# Altium project Led_panel.PrjPCB
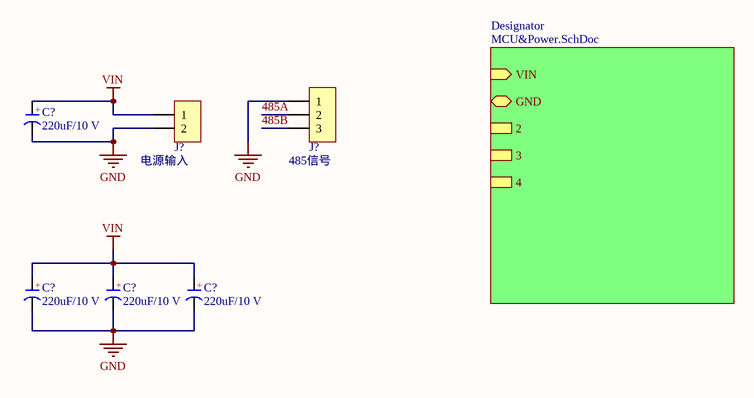
[diagram p0: Main.SchDoc]
3 sheets, 83 parts. Net scope: hierarchical (ports join the sheet entries above them; power ports are global).
Sheets:
  Main.SchDoc
    Designator = MCU&Power.SchDoc
  Row_IC.SchDoc

## Sheet Main.SchDoc
size A4

### Parts
(Parts that share a designator on the sheet are numbered #1, #2 ... from top to bottom, then left to right.)
C?#1  220uF/10 V  [CAP 1.5*4*8]
C?#2  220uF/10 V  [CAP 1.5*4*8]
C?#3  220uF/10 V  [CAP 1.5*4*8]
C?#4  220uF/10 V  [CAP 1.5*4*8]
J?#1  HDR-1X3  [KF2EDGK5.0-WI-3P]  (value not drawn)
J?#2  HDR-1X2  [KF2EDGK5.0-WI-2P]  (value not drawn)

### Sub-sheets
Designator = MCU&Power.SchDoc: VIN (in), GND (bidir), 2, 3, 4

### Nets
GND: C?#1.2(K) C?#2.2(K) C?#3.2(K) C?#4.2(K) J?#1.1 J?#2.2 ; sheet Designator/GND
VIN: C?#1.1(A) C?#2.1(A) C?#3.1(A) C?#4.1(A) J?#2.1 ; sheet Designator/VIN
485A: J?#1.2
485B: J?#1.3

### Notes on the sheet
- (near J?#2) 电源输入
- (near J?#1) 485信号
- (in symbol C-CAP) +

### Library data of the parts
C?#1-C?#4 = C-CAP: 直插电解电容; 版权归属: 源创客; BOM名称: 直插电解电容; 学习资源: www.ooocke.com
J?#1 = Header 3: 3P接插件; 版权归属: 源创客; BOM名称: 3P接插件; 学习资源: www.ooocke.com
J?#2 = Header 2: 2P接插件; 版权归属: 源创客; BOM名称: 2P接插件; 学习资源: www.ooocke.com

## Sheet MCU&Power.SchDoc
size A4
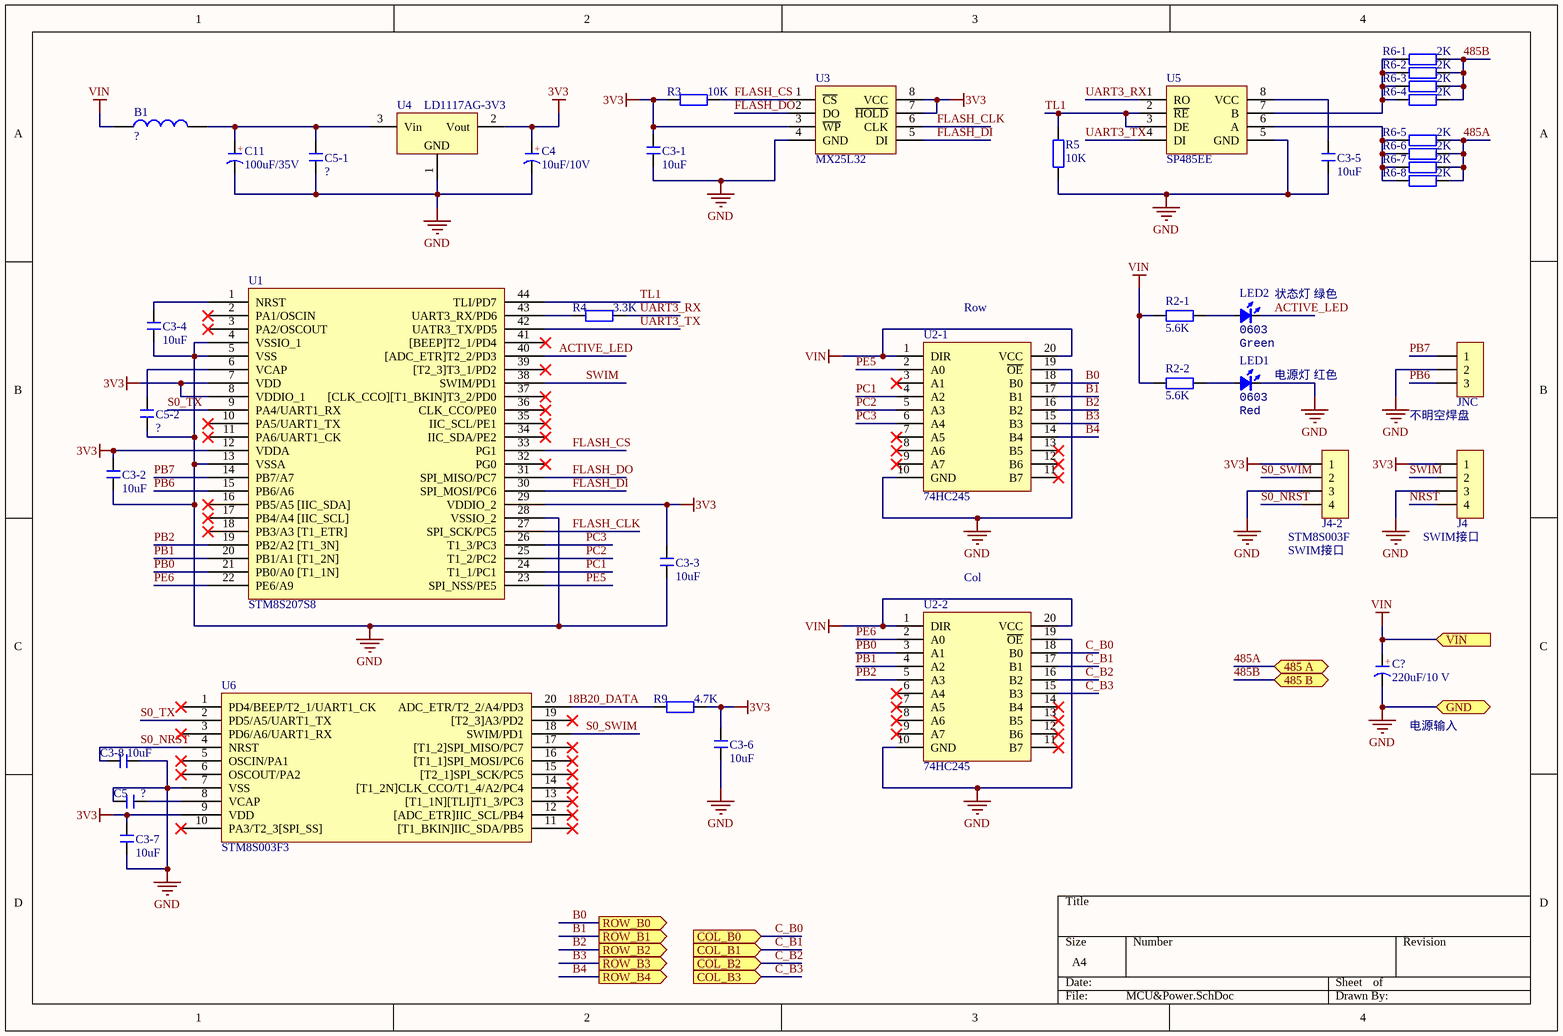
[diagram p1: MCU&Power.SchDoc]

### Parts
(Parts that share a designator on the sheet are numbered #1, #2 ... from top to bottom, then left to right.)
B1  ?  [L 0805]
C3-1  10uF  [C 0805_L]
C3-2  10uF  [C 0805_L]
C3-3  10uF  [C 0805_L]
C3-4  10uF  [C 0805_L]
C3-5  10uF  [C 0805_L]
C3-6  10uF  [C 0805_L]
C3-7  10uF  [C 0805_L]
C3-8  10uF  [C 0805_L]
C4  10uF/10V  [CD A(3216)]
C5  ?  [C 1206_L]
C5-1  ?  [C 0805_L]
C5-2  ?  [C 1206_L]
C11  100uF/35V  [CAP 1.5*4*8]
C?#5  220uF/10 V  [CAP 1.5*4*8]
J4  HDR-1X4  [XH2.54-LI-4P]  (value not drawn)
J4-2  HDR-1X4  [XH2.54-LI-4P]  (value not drawn)
JNC  HDR-1X3  [HDR2.54-LI-3P]  (value not drawn)
LED1  Type: 0603  [LED_0603_RED]  (hidden comment: Red)
LED2  Type: 0603  [LED_0603_GREEN]  (hidden comment: Green)
R2-1  5.6K  [R 0805_L]
R2-2  5.6K  [R 0805_L]
R3  10K  [R 0805_L]
R4  3.3K  [R 0805_L]
R5  10K  [R 0805_L]
R6-1  2K  [R 1206_L]
R6-2  2K  [R 1206_L]
R6-3  2K  [R 1206_L]
R6-4  2K  [R 1206_L]
R6-5  2K  [R 1206_L]
R6-6  2K  [R 1206_L]
R6-7  2K  [R 1206_L]
R6-8  2K  [R 1206_L]
R9  4.7K  [R 0805_L]
U1  STM8S207S8  [LQFP44 10X10_N]
U2-1  74HC245  [SSOP20_L]
U2-2  74HC245  [SSOP20_L]
U3  MX25L32  [SOP8W_N]
U4  LD1117AG-3V3  [SOT223_L]
U5  SP485EE  [SOP8_L]
U6  STM8S003F3  [TSSOP20_N]

### Ports
485 A (bidir), 485 B (bidir), COL_B0 (in), COL_B1 (in), COL_B2 (in), COL_B3 (in), GND (bidir), ROW_B0 (out), ROW_B1 (out), ROW_B2 (out), ROW_B3 (out), ROW_B4 (out), VIN (in)

### Nets
3V3: C3-1.2 C3-2.2 C3-3.1 C3-6.2 C3-7.2 C4.1(A) J4.1 J4-2.1 R3.1 R9.1 U1.7(VDD) U1.8(VDDIO_1) U1.12(VDDA) U1.29(VDDIO_2) U3.3(~{WP}) U3.7(~{HOLD}) U3.8(VCC) U4.2(Vout) U6.9(VDD)
GND: C3-1.1 C3-2.1 C3-3.2 C3-4.1 C3-5.2 C3-6.1 C3-7.1 C3-8.1 C4.2(K) C5.1 C5-1.1 C5-2.2 C11.2(K) C?#5.2(K) J4.3 J4-2.3 JNC.2 LED1.2(K) R5.1 U1.4(VSSIO_1) U1.5(VSS) U1.13(VSSA) U1.28(VSSIO_2) U2-1.10(GND) U2-1.19(~{OE}) U2-2.10(GND) U2-2.19(~{OE}) U3.4(GND) U4.1(GND) U5.5(GND) U6.7(VSS) ; port GND
VIN: B1.1 C?#5.1(A) R2-1.1 R2-2.1 U2-1.1(DIR) U2-1.20(VCC) U2-2.1(DIR) U2-2.20(VCC) ; port VIN
485A: R6-5.2 R6-6.2 R6-7.2 R6-8.2 ; port 485 A
485B: R6-1.2 R6-2.2 R6-3.2 R6-4.2 ; port 485 B
ACTIVE_LED: LED2.2(K) U1.40([ADC_ETR]T2_2/PD3)
B0: U2-1.18(B0) ; port ROW_B0
B1: U2-1.17(B1) ; port ROW_B1
B2: U2-1.16(B2) ; port ROW_B2
B3: U2-1.15(B3) ; port ROW_B3
B4: U2-1.14(B4) ; port ROW_B4
C_B0: U2-2.18(B0) ; port COL_B0
C_B1: U2-2.17(B1) ; port COL_B1
C_B2: U2-2.16(B2) ; port COL_B2
C_B3: U2-2.15(B3) ; port COL_B3
FLASH_CLK: U1.27(SPI_SCK/PC5) U3.6(CLK)
FLASH_CS: R3.2 U1.33(PG1) U3.1(~{CS})
FLASH_DI: U1.30(SPI_MOSI/PC6) U3.5(DI)
FLASH_DO: U1.31(SPI_MISO/PC7) U3.2(DO)
NRST: J4.4
PB0: U1.21(PB0/A0_[T1_1N]) U2-2.3(A1)
PB1: U1.20(PB1/A1_[T1_2N]) U2-2.4(A2)
PB2: U1.19(PB2/A2_[T1_3N]) U2-2.5(A3)
PB6: JNC.3 U1.15(PB6/A6)
PB7: JNC.1 U1.14(PB7/A7)
PC1: U1.24(T1_1/PC1) U2-1.4(A2)
PC2: U1.25(T1_2/PC2) U2-1.5(A3)
PC3: U1.26(T1_3/PC3) U2-1.6(A4)
PE5: U1.23(SPI_NSS/PE5) U2-1.2(A0)
PE6: U1.22(PE6/A9) U2-2.2(A0)
S0_NRST: C3-8.2 J4-2.4 U6.4(NRST)
S0_SWIM: J4-2.2 U6.18(SWIM/PD1)
S0_TX: U1.9(PA4/UART1_RX) U6.2(PD5/A5/UART1_TX)
SWIM: J4.2 U1.38(SWIM/PD1)
TL1: R5.2 U1.44(TLI/PD7) U5.2(~{RE}) U5.3(DE)
UART3_RX: R4.2 U5.1(RO)
UART3_TX: U1.42(UATR3_TX/PD5) U5.4(DI)
NetB1_2: B1.2 C5-1.2 C11.1(A) U4.3(Vin)
NetC3-4_2: C3-4.2 U1.1(NRST)
NetC3-5_1: C3-5.1 U5.8(VCC)
NetC5-2_1: C5-2.1 U1.6(VCAP)
NetC5_2: C5.2 U6.8(VCAP)
NetLED1_1: LED1.1(A) R2-2.2
NetLED2_1: LED2.1(A) R2-1.2
NetR4_1: R4.1 U1.43(UART3_RX/PD6)
NetR6-1_1: R6-1.1 R6-2.1 R6-3.1 R6-4.1 U5.7(B)
NetR6-5_1: R6-5.1 R6-6.1 R6-7.1 R6-8.1 U5.6(A)
NetR9_2: R9.2 U6.20(ADC_ETR/T2_2/A4/PD3)

Not connected (* = marked no-connect by the designer): U1 2(PA1/OSCIN)* 3(PA2/OSCOUT)* 10(PA5/UART1_TX)* 11(PA6/UART1_CK)* 16(PB5/A5_[IIC_SDA])* 17(PB4/A4_[IIC_SCL])* 18(PB3/A3_[T1_ETR])* 32(PG0)* 34(IIC_SDA/PE2)* 35(IIC_SCL/PE1)* 36(CLK_CCO/PE0)* 37([CLK_CCO][T1_BKIN]T3_2/PD0)* 39([T2_3]T3_1/PD2)* 41([BEEP]T2_1/PD4)*; U2-1 3(A1)* 7(A5)* 8(A6)* 9(A7)* 11(B7)* 12(B6)* 13(B5)*; U2-2 6(A4)* 7(A5)* 8(A6)* 9(A7)* 11(B7)* 12(B6)* 13(B5)* 14(B4)*; U6 1(PD4/BEEP/T2_1/UART1_CK)* 3(PD6/A6/UART1_RX)* 5(OSCIN/PA1)* 6(OSCOUT/PA2)* 10(PA3/T2_3[SPI_SS])* 11([T1_BKIN]IIC_SDA/PB5)* 12([ADC_ETR]IIC_SCL/PB4)* 13([T1_1N][TLI]T1_3/PC3)* 14([T1_2N]CLK_CCO/T1_4/A2/PC4)* 15([T2_1]SPI_SCK/PC5)* 16([T1_1]SPI_MOSI/PC6)* 17([T1_2]SPI_MISO/PC7)* 19([T2_3]A3/PD2)*

### Notes on the sheet
- (near U2-1) Row
- (near LED2) 状态灯 绿色
- (near LED1) 电源灯 红色
- 不明空焊盘
- (near U2-2) Col
- (near J4-2) STM8S003F
- (near J4-2) SWIM接口
- (near J4) SWIM接口
- 电源输入
- Labels drawn without touching a wire or pin: 18B20_DATA
- (in symbol C-CAP) +
- (in symbol C-CD) +

### Library data of the parts
B1 = L: 小功率贴片电感; 版权归属: 源创客; BOM名称: 小功率贴片电感; 学习资源: www.ooocke.com
C3-1-C3-8 C5 C5-1 C5-2 = C: 无极性贴片电容; 版权归属: 源创客; BOM名称: 无极性贴片电容; 学习资源: www.ooocke.com
C4 = C-CD: 贴片钽电容; 版权归属: 源创客; BOM名称: 贴片钽电容; 学习资源: www.ooocke.com
C11 C?#5 = C-CAP: 直插电解电容; 版权归属: 源创客; BOM名称: 直插电解电容; 学习资源: www.ooocke.com
J4 J4-2 = Header 4: 4P接插件; 版权归属: 源创客; BOM名称: 4P接插件; 学习资源: www.ooocke.com
JNC = Header 3: 3P接插件; 版权归属: 源创客; BOM名称: 3P接插件; 学习资源: www.ooocke.com
LED1 LED2 = LED_0603: LED
  LED1: Value: Red
  LED2: Value: Green
R2-1 R2-2 R3-R5 R6-1-R6-8 R9 = R: 贴片电阻; 版权归属: 源创客; BOM名称: 贴片电阻; 学习资源: www.ooocke.com
U1 = STM8S207S8: Flash: 64K,   RAM: 6K,  IO: 34; BOM名称: 8位STM单片机; 版权归属: 源创客; 学习资源: www.ooocke.com
U3 = W25Qxx: 外置Flash; 版权归属: 源创客; BOM名称: 外置Flash; 学习资源: www.ooocke.com
U4 = AMS1117: 三端稳压芯片; BOM名称: 稳压芯片; 版权归属: 源创客; 学习资源: www.ooocke.com
U6 = STM8S003F3: Flash: 8K,     RAM: 1K,  IO: 16; BOM名称: 8位STM单片机; 版权归属: 源创客; 学习资源: www.ooocke.com

## Sheet Row_IC.SchDoc
size A4
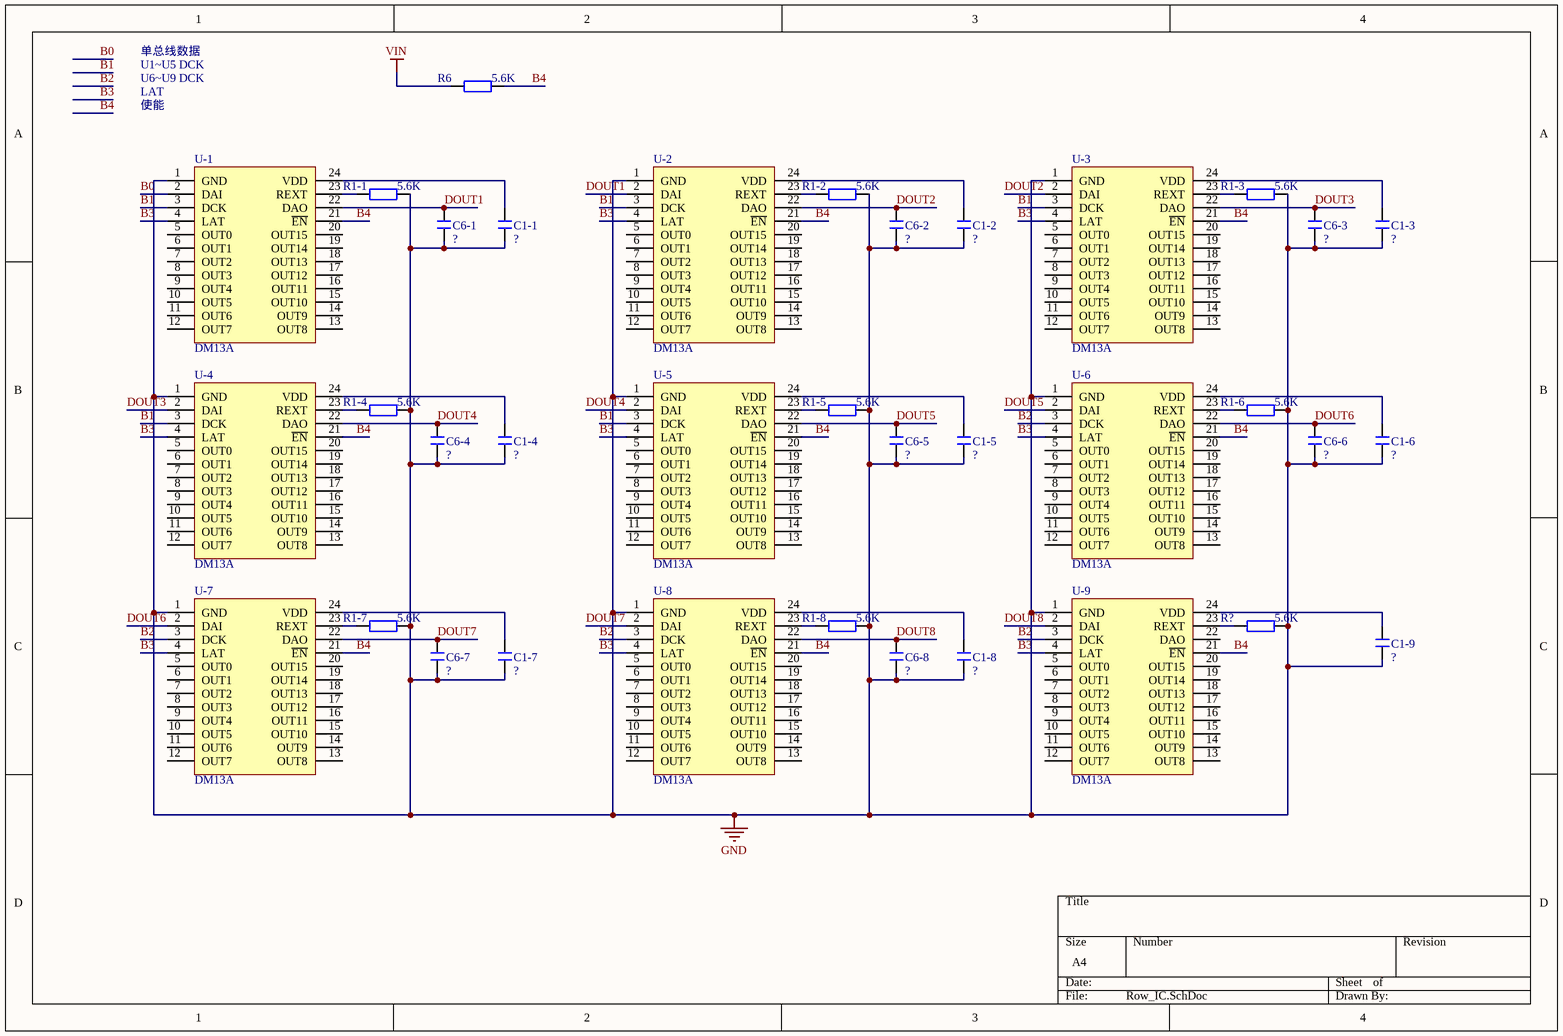
[diagram p2: Row_IC.SchDoc]

### Parts
C1-1  ?  [C 0805_L]
C1-2  ?  [C 0805_L]
C1-3  ?  [C 0805_L]
C1-4  ?  [C 0805_L]
C1-5  ?  [C 0805_L]
C1-6  ?  [C 0805_L]
C1-7  ?  [C 0805_L]
C1-8  ?  [C 0805_L]
C1-9  ?  [C 0805_L]
C6-1  ?  [C 0603_L]
C6-2  ?  [C 0603_L]
C6-3  ?  [C 0603_L]
C6-4  ?  [C 0603_L]
C6-5  ?  [C 0603_L]
C6-6  ?  [C 0603_L]
C6-7  ?  [C 0603_L]
C6-8  ?  [C 0603_L]
R1-1  5.6K  [R 0805_L]
R1-2  5.6K  [R 0805_L]
R1-3  5.6K  [R 0805_L]
R1-4  5.6K  [R 0805_L]
R1-5  5.6K  [R 0805_L]
R1-6  5.6K  [R 0805_L]
R1-7  5.6K  [R 0805_L]
R1-8  5.6K  [R 0805_L]
R6  5.6K  [R 0805_L]
R?  5.6K  [R 0805_L]
U-1  DM13A  [TSSOP24_M]
U-2  DM13A  [TSSOP24_M]
U-3  DM13A  [TSSOP24_M]
U-4  DM13A  [TSSOP24_M]
U-5  DM13A  [TSSOP24_M]
U-6  DM13A  [TSSOP24_M]
U-7  DM13A  [TSSOP24_M]
U-8  DM13A  [TSSOP24_M]
U-9  DM13A  [TSSOP24_M]

### Nets
GND: C1-1.2 C1-2.2 C1-3.2 C1-4.2 C1-5.2 C1-6.2 C1-7.2 C1-8.2 C1-9.2 C6-1.1 C6-2.1 C6-3.1 C6-4.1 C6-5.1 C6-6.1 C6-7.1 C6-8.1 R1-1.2 R1-2.2 R1-3.2 R1-4.2 R1-5.2 R1-6.2 R1-7.2 R1-8.2 R?.2 U-1.1(GND) U-2.1(GND) U-3.1(GND) U-4.1(GND) U-5.1(GND) U-6.1(GND) U-7.1(GND) U-8.1(GND) U-9.1(GND)
VIN: R6.1
B0: U-1.2(DAI)
B1: U-1.3(DCK) U-2.3(DCK) U-3.3(DCK) U-4.3(DCK) U-5.3(DCK)
B2: U-6.3(DCK) U-7.3(DCK) U-8.3(DCK) U-9.3(DCK)
B3: U-1.4(LAT) U-2.4(LAT) U-3.4(LAT) U-4.4(LAT) U-5.4(LAT) U-6.4(LAT) U-7.4(LAT) U-8.4(LAT) U-9.4(LAT)
B4: R6.2 U-1.21(~{EN}) U-2.21(~{EN}) U-3.21(~{EN}) U-4.21(~{EN}) U-5.21(~{EN}) U-6.21(~{EN}) U-7.21(~{EN}) U-8.21(~{EN}) U-9.21(~{EN})
DOUT1: C6-1.2 U-1.22(DAO) U-2.2(DAI)
DOUT2: C6-2.2 U-2.22(DAO) U-3.2(DAI)
DOUT3: C6-3.2 U-3.22(DAO) U-4.2(DAI)
DOUT4: C6-4.2 U-4.22(DAO) U-5.2(DAI)
DOUT5: C6-5.2 U-5.22(DAO) U-6.2(DAI)
DOUT6: C6-6.2 U-6.22(DAO) U-7.2(DAI)
DOUT7: C6-7.2 U-7.22(DAO) U-8.2(DAI)
DOUT8: C6-8.2 U-8.22(DAO) U-9.2(DAI)
NetC1-1_1: C1-1.1 U-1.24(VDD)
NetC1-2_1: C1-2.1 U-2.24(VDD)
NetC1-3_1: C1-3.1 U-3.24(VDD)
NetC1-4_1: C1-4.1 U-4.24(VDD)
NetC1-5_1: C1-5.1 U-5.24(VDD)
NetC1-6_1: C1-6.1 U-6.24(VDD)
NetC1-7_1: C1-7.1 U-7.24(VDD)
NetC1-8_1: C1-8.1 U-8.24(VDD)
NetC1-9_1: C1-9.1 U-9.24(VDD)
NetR1-1_1: R1-1.1 U-1.23(REXT)
NetR1-2_1: R1-2.1 U-2.23(REXT)
NetR1-3_1: R1-3.1 U-3.23(REXT)
NetR1-4_1: R1-4.1 U-4.23(REXT)
NetR1-5_1: R1-5.1 U-5.23(REXT)
NetR1-6_1: R1-6.1 U-6.23(REXT)
NetR1-7_1: R1-7.1 U-7.23(REXT)
NetR1-8_1: R1-8.1 U-8.23(REXT)
NetR?_1: R?.1 U-9.23(REXT)

Not connected (* = marked no-connect by the designer): U-1 5(OUT0) 6(OUT1) 7(OUT2) 8(OUT3) 9(OUT4) 10(OUT5) 11(OUT6) 12(OUT7) 13(OUT8) 14(OUT9) 15(OUT10) 16(OUT11) 17(OUT12) 18(OUT13) 19(OUT14) 20(OUT15); U-2 5(OUT0) 6(OUT1) 7(OUT2) 8(OUT3) 9(OUT4) 10(OUT5) 11(OUT6) 12(OUT7) 13(OUT8) 14(OUT9) 15(OUT10) 16(OUT11) 17(OUT12) 18(OUT13) 19(OUT14) 20(OUT15); U-3 5(OUT0) 6(OUT1) 7(OUT2) 8(OUT3) 9(OUT4) 10(OUT5) 11(OUT6) 12(OUT7) 13(OUT8) 14(OUT9) 15(OUT10) 16(OUT11) 17(OUT12) 18(OUT13) 19(OUT14) 20(OUT15); U-4 5(OUT0) 6(OUT1) 7(OUT2) 8(OUT3) 9(OUT4) 10(OUT5) 11(OUT6) 12(OUT7) 13(OUT8) 14(OUT9) 15(OUT10) 16(OUT11) 17(OUT12) 18(OUT13) 19(OUT14) 20(OUT15); U-5 5(OUT0) 6(OUT1) 7(OUT2) 8(OUT3) 9(OUT4) 10(OUT5) 11(OUT6) 12(OUT7) 13(OUT8) 14(OUT9) 15(OUT10) 16(OUT11) 17(OUT12) 18(OUT13) 19(OUT14) 20(OUT15); U-6 5(OUT0) 6(OUT1) 7(OUT2) 8(OUT3) 9(OUT4) 10(OUT5) 11(OUT6) 12(OUT7) 13(OUT8) 14(OUT9) 15(OUT10) 16(OUT11) 17(OUT12) 18(OUT13) 19(OUT14) 20(OUT15); U-7 5(OUT0) 6(OUT1) 7(OUT2) 8(OUT3) 9(OUT4) 10(OUT5) 11(OUT6) 12(OUT7) 13(OUT8) 14(OUT9) 15(OUT10) 16(OUT11) 17(OUT12) 18(OUT13) 19(OUT14) 20(OUT15); U-8 5(OUT0) 6(OUT1) 7(OUT2) 8(OUT3) 9(OUT4) 10(OUT5) 11(OUT6) 12(OUT7) 13(OUT8) 14(OUT9) 15(OUT10) 16(OUT11) 17(OUT12) 18(OUT13) 19(OUT14) 20(OUT15); U-9 5(OUT0) 6(OUT1) 7(OUT2) 8(OUT3) 9(OUT4) 10(OUT5) 11(OUT6) 12(OUT7) 13(OUT8) 14(OUT9) 15(OUT10) 16(OUT11) 17(OUT12) 18(OUT13) 19(OUT14) 20(OUT15) 22(DAO)

### Notes on the sheet
- 单总线数据
- U1~U5 DCK
- U6~U9 DCK
- LAT
- 使能

### Library data of the parts
C1-1-C1-9 C6-1-C6-8 = C: 无极性贴片电容; 版权归属: 源创客; BOM名称: 无极性贴片电容; 学习资源: www.ooocke.com
R1-1-R1-8 R6 R? = R: 贴片电阻; 版权归属: 源创客; BOM名称: 贴片电阻; 学习资源: www.ooocke.com

## Nets that join several sheets
GND: Main (6 pins), MCU&Power (31 pins), Row_IC (35 pins)
VIN: Main (5 pins), MCU&Power (8 pins), Row_IC (R6.1)